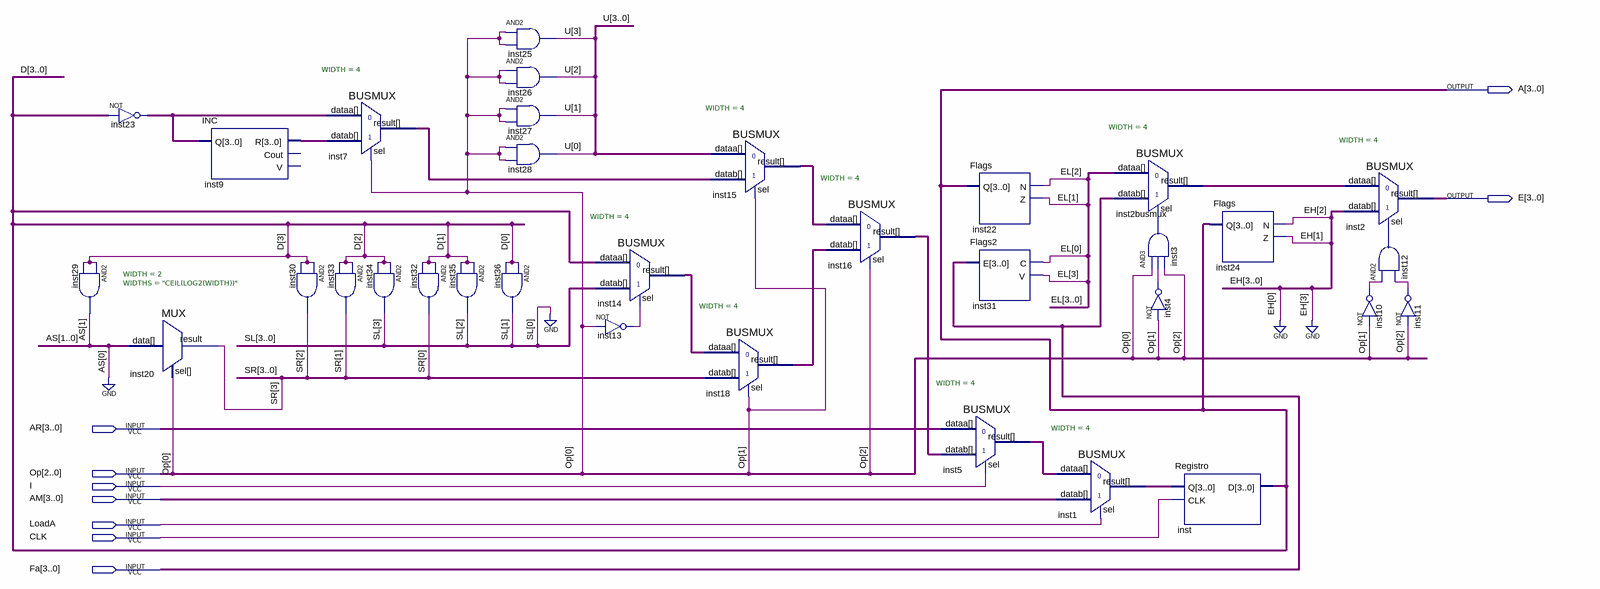
[diagram p0: schematic sheet]
// Quartus schematic RegistroA.bdf as structural Verilog: 33 symbols, 9 pins
module RegistroA (
  input  [3:0] AR,
  input  [2:0] Op,
  input  I,
  input  [3:0] AM,
  input  LoadA,
  input  CLK,
  input  [3:0] Fa,
  output [3:0] A,
  output [3:0] E
);

  wire inst3_out, inst4_out, inst10_out, inst11_out, inst12_out, inst13_out;
  wire [1:1] AS;
  wire [2:1] EH;
  wire [3:0] EL, inst1_result, inst2busmux_result, inst5_result, inst7_result, inst9_r, inst14_result,
       inst15_result, inst16_result, inst18_result, inst23_out, SR, U;
  wire [3:1] SL;

  and inst29 (AS[1], A[3], A[3]);
  assign inst23_out = ~A;  // NOT inst23, 4 bits wide
  MUX #(.WIDTH(2), .WIDTHS("CEIL(LOG2(WIDTH))")) inst20 (.data({AS[1], 1'b0}), .sel(Op[0]), .result(SR[3]));
  INC inst9 (.Q(inst23_out), .R(inst9_r));  // open: Cout, V
  and inst30 (SR[2], A[3], A[3]);
  BUSMUX #(.WIDTH(4)) inst7 (.datab(inst9_r), .sel(Op[0]), .dataa(inst23_out), .result(inst7_result));
  and inst33 (SR[1], A[2], A[2]);
  and inst34 (SL[3], A[2], A[2]);
  and inst32 (SR[0], A[1], A[1]);
  and inst35 (SL[2], A[1], A[1]);
  and inst36 (SL[1], A[0], A[0]);
  and inst25 (U[3], Op[0], Op[0]);
  and inst26 (U[2], Op[0], Op[0]);
  and inst27 (U[1], Op[0], Op[0]);
  and inst28 (U[0], Op[0], Op[0]);
  BUSMUX #(.WIDTH(4)) inst14 (.datab({SL, 1'b0}), .sel(inst13_out), .dataa(A), .result(inst14_result));
  not inst13 (inst13_out, Op[0]);
  BUSMUX #(.WIDTH(4)) inst18 (.datab(SR), .sel(Op[1]), .dataa(inst14_result), .result(inst18_result));
  BUSMUX #(.WIDTH(4)) inst15 (.datab(inst7_result), .sel(Op[1]), .dataa(U), .result(inst15_result));
  BUSMUX #(.WIDTH(4)) inst16 (.datab(inst18_result), .sel(Op[2]), .dataa(inst15_result), .result(inst16_result));
  BUSMUX #(.WIDTH(4)) inst5 (.datab(inst16_result), .sel(I), .dataa(AR), .result(inst5_result));
  Flags inst22 (.Q(A), .N(EL[2]), .Z(EL[1]));
  Flags2 inst31 (.E(Fa), .C(EL[0]), .V(EL[3]));
  BUSMUX #(.WIDTH(4)) inst1 (.datab(AM), .sel(LoadA), .dataa(inst5_result), .result(inst1_result));
  BUSMUX #(.WIDTH(4)) inst2busmux (.datab(Fa), .sel(inst3_out), .dataa(EL), .result(inst2busmux_result));
  and inst3 (inst3_out, Op[0], inst4_out, Op[2]);
  not inst4 (inst4_out, Op[1]);
  Flags inst24 (.Q(A), .N(EH[2]), .Z(EH[1]));
  Registro inst (.Q(inst1_result), .CLK(CLK), .D(A));
  BUSMUX #(.WIDTH(4)) inst2 (.datab({1'b0, EH, 1'b0}), .sel(inst12_out), .dataa(inst2busmux_result), .result(E));
  and inst12 (inst12_out, inst10_out, inst11_out);
  not inst10 (inst10_out, Op[1]);
  not inst11 (inst11_out, Op[2]);

  // Other names for the same wires on the sheet: D[3:0] = A
endmodule
